# Altium schematic sheet Sheet1.SchDoc
size A3
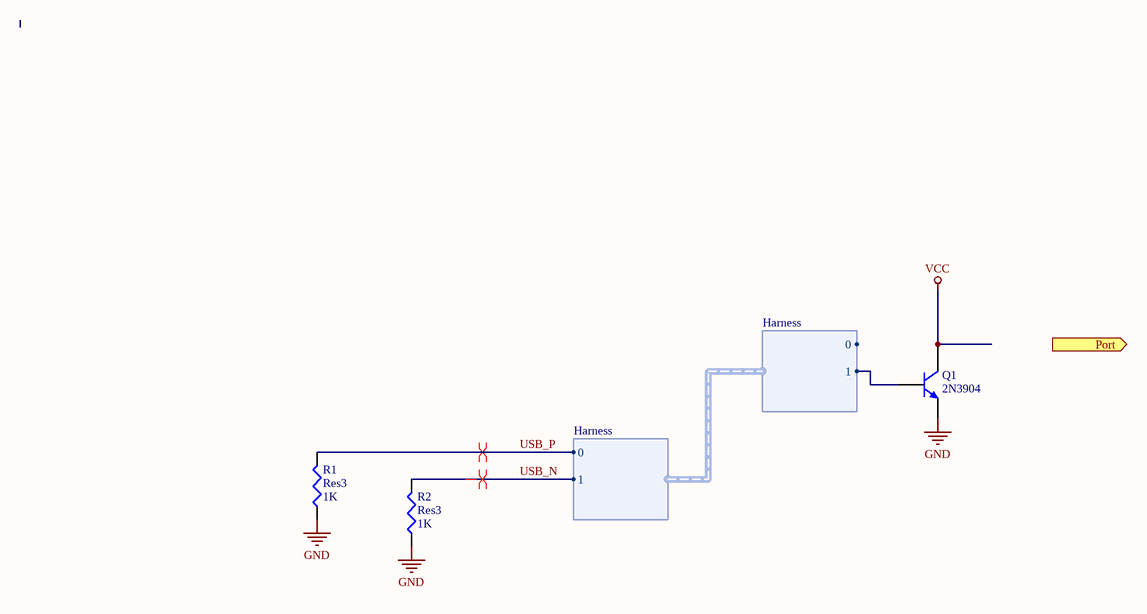
[diagram p0: Sheet1.SchDoc]

## Parts
Q1  2N3904  [TO-92A]
R1  Res3  value 1K  [J1-0603]
R2  Res3  value 1K  [J1-0603]

## Ports
Port (out)

## Harnesses
Harness: 0, 1
Harness: 1, 0

## Nets
GND: R1.1 R2.1
VCC: Q1.3(C)
USB_N: Q1.2(B) R2.2 ; harness Harness.1
USB_P: R1.2 ; harness Harness.0

Not connected (* = marked no-connect by the designer): Q1 1(E)

## Layout directives
differential pair: USB_N, USB_P

## Notes on the sheet
- Labels drawn without touching a wire or pin: GND

## Library data of the parts
Q1 = 2N3904: NPN General Purpose Amplifier; Published: 8-Jun-2000; LatestRevisionDate: 15-Jan-2003; LatestRevisionNote: PCB Footprint 'BCY-W3/D4.7' replaced; DatasheetVersion: 1997; PackageVersion: Sep-1998; PackageReference: TO-92A; Publisher: Altium Limited; PackageDescription: TO, Flat Index; 3 In-Line, Axial Leads; Body Dia. 4.5mm; Leads 0.51 x 0.48 mm (max); ComponentLink1Description: Manufacturer Link; ComponentLink1URL: http://www.fairchildsemi.com/; ComponentLink2Description: Datasheet; ComponentLink2URL: http://www.fairchildsemi.com/ds/2N%2F2N3904.pdf
R1 R2 = Res3: Resistor; Published: 8-Jun-2000; LatestRevisionDate: 29-May-2009; LatestRevisionNote: IPC-7351 Footprint Added.; PackageReference: J1-0603; Publisher: Altium Limited; PackageDescription: Chip Resistor